# EAGLE design G792A (EAGLE 6.6.0)
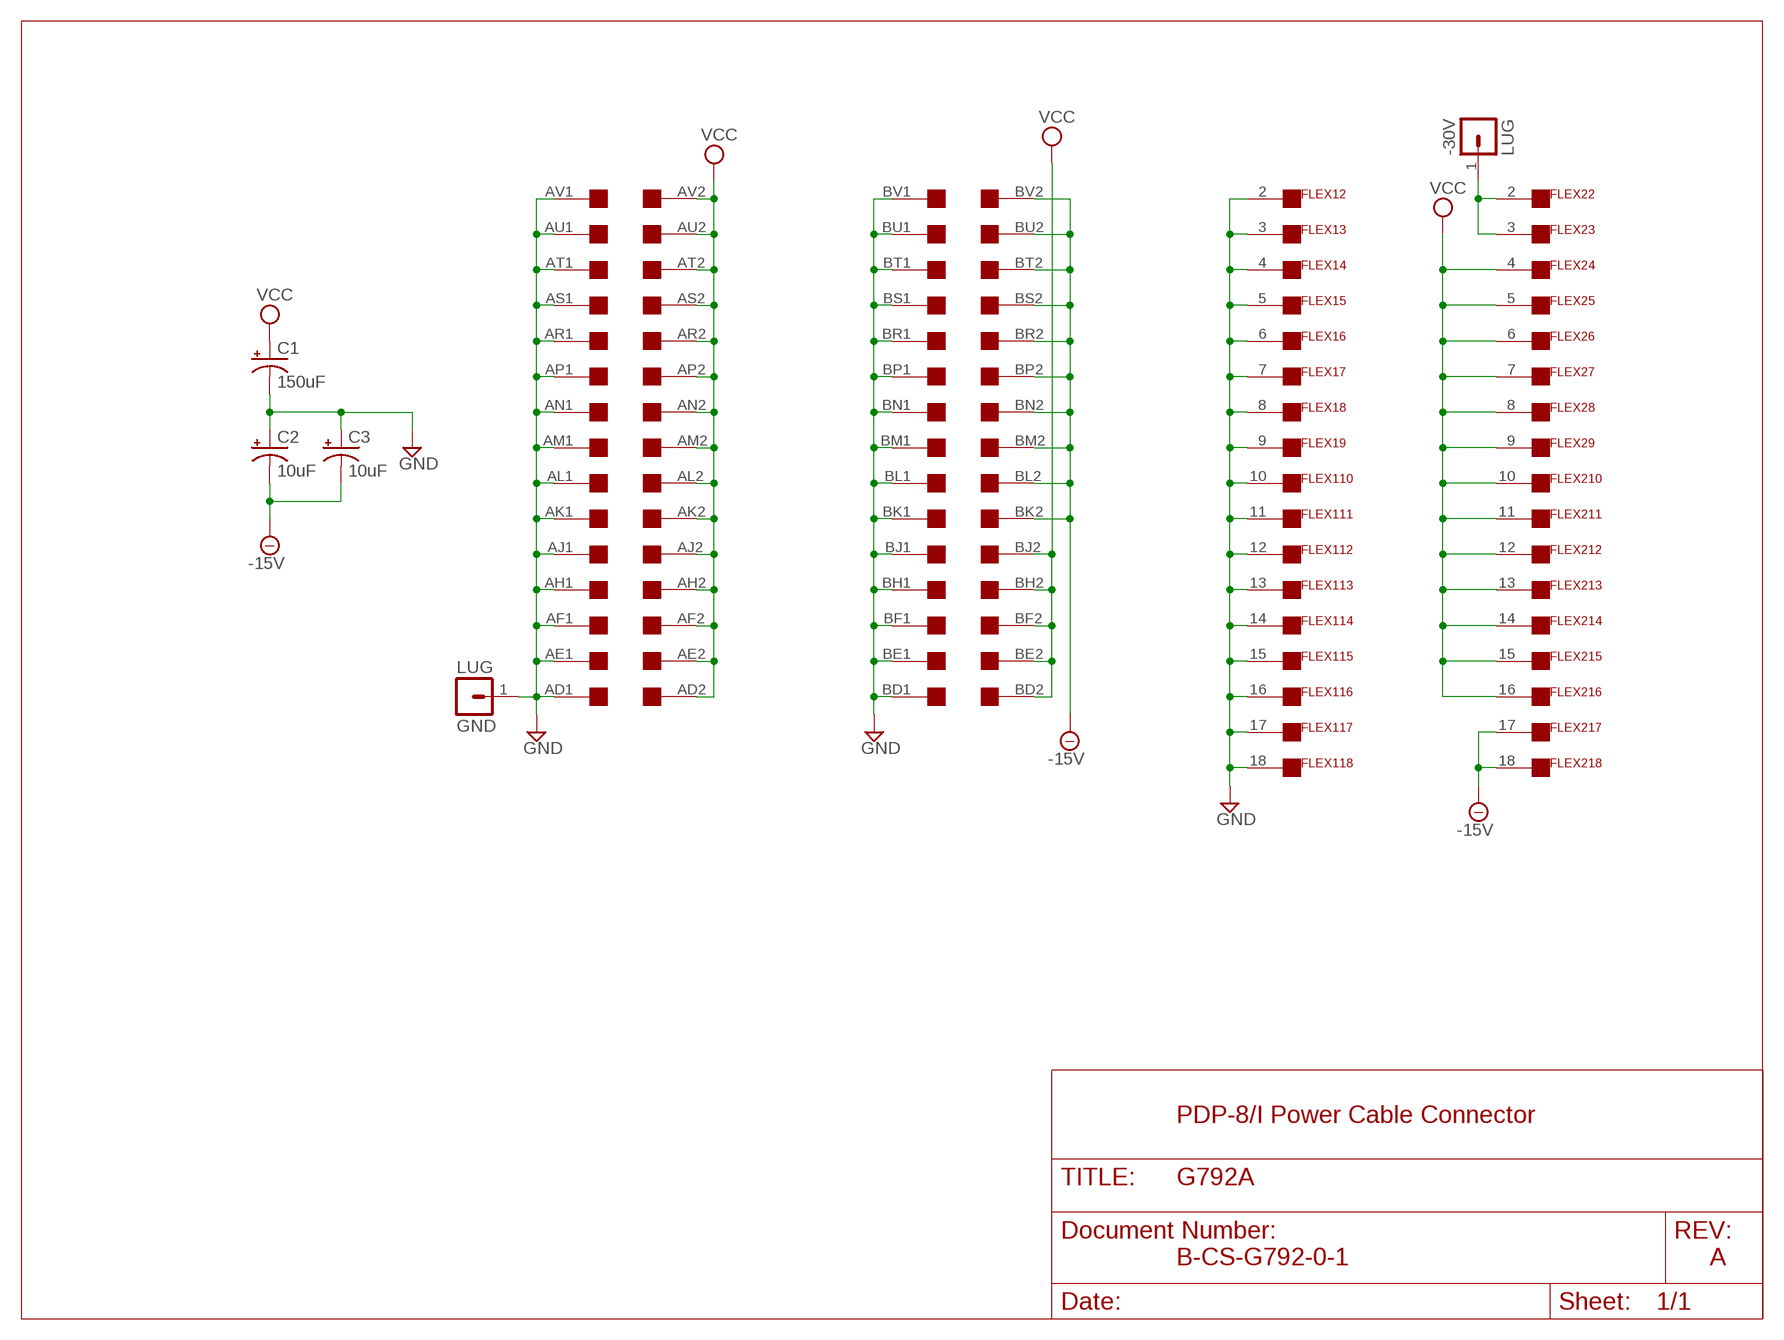
[diagram p0: schematic, sheet 1]

## Parts
-30V  LUG  [SPADELUG]
C1  150uF  CPOL-USE25-9AXIAL  [E25-9]
C2  10uF  CPOL-USE25-9AXIAL  [E25-9]
C3  10uF  CPOL-USE25-9AXIAL  [E25-9]
FLEX1  FLEX19W  [FLEX19W]
FLEX2  FLEX19W  [FLEX19W]
GND  LUG  [SPADELUG]
U$2  DOUBLE  [EDGE-CON4]

## Nets
-15V [supply]: C2.- C3.- FLEX2.17 FLEX2.18 U$2.BK2 U$2.BL2 U$2.BM2 U$2.BN2 U$2.BP2 U$2.BR2 U$2.BS2 U$2.BT2 U$2.BU2 U$2.BV2
-30V [supply]: -30V.1 FLEX2.2 FLEX2.3
GND [supply]: C1.- C2.+ C3.+ FLEX1.2 FLEX1.3 FLEX1.4 FLEX1.5 FLEX1.6 FLEX1.7 FLEX1.8 FLEX1.9 FLEX1.10 FLEX1.11 FLEX1.12 FLEX1.13 FLEX1.14 FLEX1.15 FLEX1.16 FLEX1.17 FLEX1.18 GND.1 U$2.AD1 U$2.AE1 U$2.AF1 U$2.AH1 U$2.AJ1 U$2.AK1 U$2.AL1 U$2.AM1 U$2.AN1 U$2.AP1 U$2.AR1 U$2.AS1 U$2.AT1 U$2.AU1 U$2.AV1 U$2.BD1 U$2.BE1 U$2.BF1 U$2.BH1 U$2.BJ1 U$2.BK1 U$2.BL1 U$2.BM1 U$2.BN1 U$2.BP1 U$2.BR1 U$2.BS1 U$2.BT1 U$2.BU1 U$2.BV1
VCC: C1.+ FLEX2.4 FLEX2.5 FLEX2.6 FLEX2.7 FLEX2.8 FLEX2.9 FLEX2.10 FLEX2.11 FLEX2.12 FLEX2.13 FLEX2.14 FLEX2.15 FLEX2.16 U$2.AD2 U$2.AE2 U$2.AF2 U$2.AH2 U$2.AJ2 U$2.AK2 U$2.AL2 U$2.AM2 U$2.AN2 U$2.AP2 U$2.AR2 U$2.AS2 U$2.AT2 U$2.AU2 U$2.AV2 U$2.BD2 U$2.BE2 U$2.BF2 U$2.BH2 U$2.BJ2
Unconnected: FLEX1.1 FLEX1.19 FLEX2.1 FLEX2.19 U$2.AA1 U$2.AA2 U$2.AB1 U$2.AB2 U$2.AC1 U$2.AC2 U$2.BA1 U$2.BA2 U$2.BB1 U$2.BB2 U$2.BC1 U$2.BC2

## Notes on the sheet
- PDP-8/I Power Cable Connector
- B-CS-G792-0-1 | A

## Library data of the parts
-30V GND = dec-con:LUG: Spade Lug
C1-C3 = rcl:CPOL-US: POLARIZED CAPACITOR, American symbol
FLEX1 FLEX2 = dec-con:FLEX19: 19 pin Flexprint Connection
U$2 = dec-con:DOUBLE: Double-Height DEC board

## Net classes
1 supply: width 0.813 mm

## Board
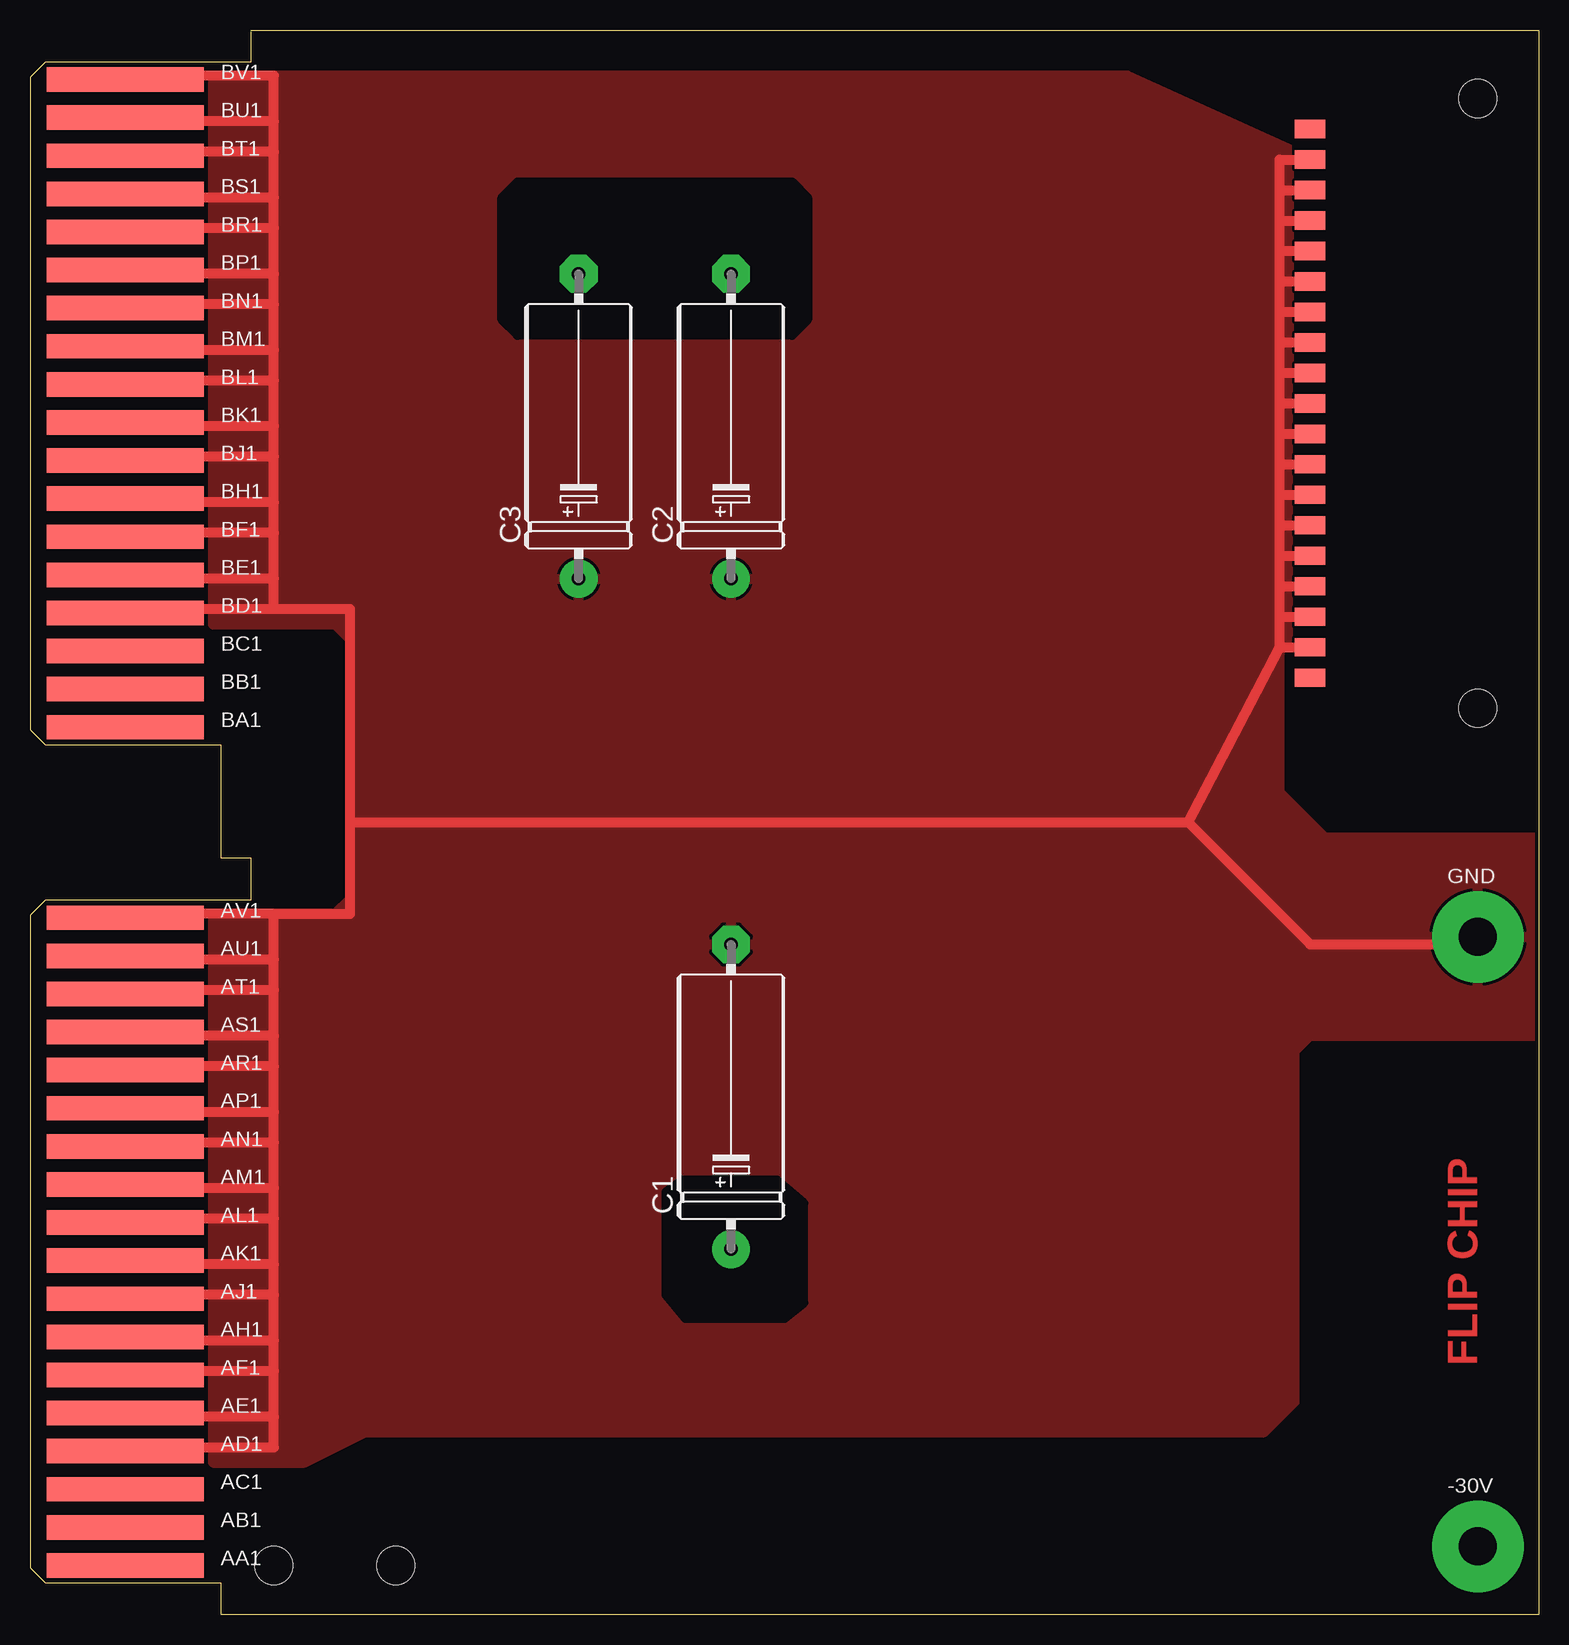
[diagram p1: board, top side]
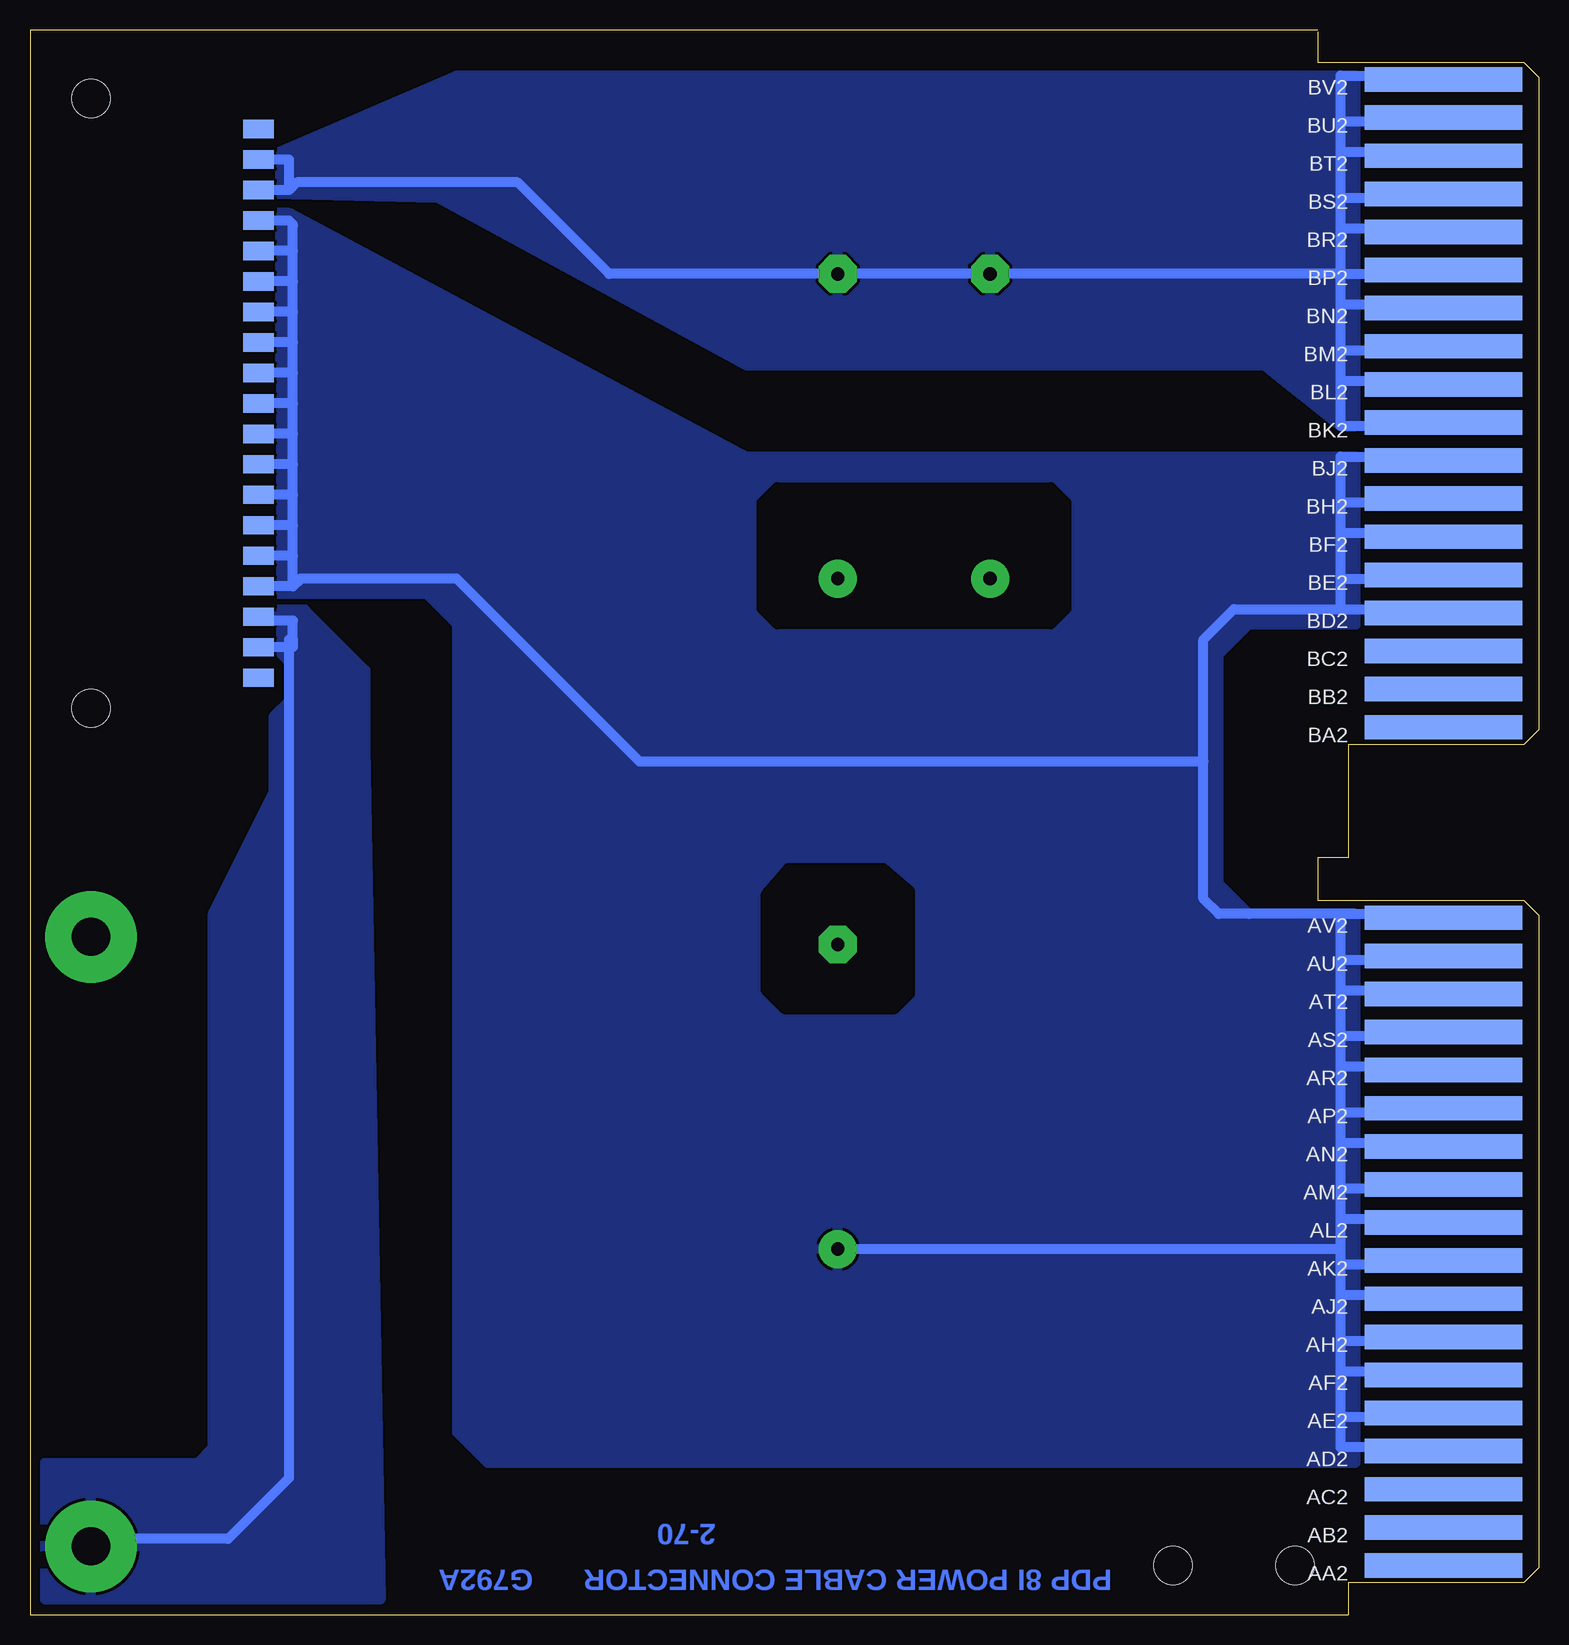
[diagram p2: board, bottom side, seen from below]

Size 125.73 x 132.08 mm. Coordinates in mm from the lower left corner, seen from the top.
Outline: 18.41,132.08 125.73,132.08 125.73,0 15.88,0
Copper layers (1+16): Top 0.035mm / dielectric 1.5mm / Bottom 0.035mm
Design rules "16mils": minimum track width 16mil, minimum drill 32mil, track to track 15mil, track to pad 10mil, pad to pad 10mil, via to via 10mil, smd to smd 10mil, copper to edge 13mil, drill to drill 10mil, minimum pad ring 10mil, minimum via ring 8mil, stop-mask expansion 0mil, vias tented up to drill 0mil, thermal gap 10mil
Holes 3.17 mm at 20.32,4.13 30.48,4.13 120.65,75.56 120.65,126.36
tRestrict: 16 lines
bRestrict: 16 lines

### Footprints (pad centres in the part's own frame; a part is rotated, then mirrored left to right if it is on the bottom)
SPADELUG = drill 3.175 pad 7.62: 1 0,0
E25-9 = drill 1.118 pad 3.15: + -12.7,0 | drill 1.118 pad 3.15 octagon: - 12.7,0
FLEX19W = smd 2.54 x 1.524: 1 0,22.86; 2 0,20.32; 3 0,17.78; 4 0,15.24; 5 0,12.7; 6 0,10.16; 7 0,7.62; 8 0,5.08; 9 0,2.54; 10 0,0; 11 0,-2.54; 12 0,-5.08; 13 0,-7.62; 14 0,-10.16; 15 0,-12.7; 16 0,-15.24; 17 0,-17.78; 18 0,-20.32; 19 0,-22.86
EDGE-CON4 = smd 13.106 x 2.032: AA1 7.938,4.128; AB1 7.938,7.303; AC1 7.938,10.477; AD1 7.938,13.652; AE1 7.938,16.828; AF1 7.938,20.003; AH1 7.938,23.177; AJ1 7.938,26.352; AK1 7.938,29.527; AL1 7.938,32.703; AM1 7.938,35.877; AN1 7.938,39.053; AP1 7.938,42.227; AR1 7.938,45.403; AS1 7.938,48.578; AT1 7.938,51.752; AU1 7.938,54.928; AV1 7.938,58.102; BA1 7.938,73.978; BB1 7.938,77.153; BC1 7.938,80.328; BD1 7.938,83.502; BE1 7.938,86.677; BF1 7.938,89.853; BH1 7.938,93.028; BJ1 7.938,96.203; BK1 7.938,99.377; BL1 7.938,102.552; BM1 7.938,105.728; BN1 7.938,108.903; BP1 7.938,112.078; BR1 7.938,115.252; BS1 7.938,118.427; BT1 7.938,121.603; BU1 7.938,124.778; BV1 7.938,127.953 | smd 13.106 x 2.032 bottom: AA2 7.938,4.128; AB2 7.938,7.303; AC2 7.938,10.477; AD2 7.938,13.652; AE2 7.938,16.828; AF2 7.938,20.003; AH2 7.938,23.177; AJ2 7.938,26.352; AK2 7.938,29.527; AL2 7.938,32.703; AM2 7.938,35.877; AN2 7.938,39.053; AP2 7.938,42.227; AR2 7.938,45.403; AS2 7.938,48.578; AT2 7.938,51.752; AU2 7.938,54.928; AV2 7.938,58.102; BA2 7.938,73.978; BB2 7.938,77.153; BC2 7.938,80.328; BD2 7.938,83.502; BE2 7.938,86.677; BF2 7.938,89.853; BH2 7.938,93.028; BJ2 7.938,96.203; BK2 7.938,99.377; BL2 7.938,102.552; BM2 7.938,105.728; BN2 7.938,108.903; BP2 7.938,112.078; BR2 7.938,115.252; BS2 7.938,118.427; BT2 7.938,121.603; BU2 7.938,124.778; BV2 7.938,127.953

### Placement (x,y rotation side)
-30V  120.65,5.71 0 top
C1  58.42,43.18 90 top
C2  58.42,99.06 90 top
C3  45.72,99.06 90 top
FLEX1  106.68,100.97 0 top
FLEX2  106.68,100.97 180 bottom
GND  120.65,56.52 0 top
U$2  0,0 0 top
U$3  [FLIPCHIP]  123.19,57.15 180 top

### Tracks (layer width: path | path; a pad name or v marks a point on that pad's centre or on a via)
-15V
  Bottom 0.813: FLEX2.18 104.14,121.28 104.14,118.75 | 104.14,118.75 FLEX2.17 | U$2.BV2 8.26,128.27 16.51,128.27 16.51,124.46 | 16.51,102.87 16.51,99.06 8.26,99.06 U$2.BK2 | 16.51,102.87 16.51,105.41 | 16.51,105.41 16.51,109.22 | 16.51,109.22 16.51,111.76 | 16.51,111.76 16.51,115.57 | 16.51,115.57 16.51,118.11 | 16.51,118.11 16.51,121.92 | 16.51,121.92 16.51,124.46 | U$2.BL2 8.26,102.87 16.51,102.87 | U$2.BM2 8.26,105.41 16.51,105.41 | U$2.BN2 8.26,109.22 16.51,109.22 | U$2.BP2 8.26,111.76 16.51,111.76 | U$2.BR2 8.26,115.57 16.51,115.57 | U$2.BS2 8.26,118.11 16.51,118.11 | U$2.BT2 8.26,121.92 16.51,121.92 | U$2.BU2 8.26,124.46 16.51,124.46 | 16.51,111.76 C3.- C2.- 77.47,111.76 85.09,119.38 103.5,119.38 104.14,118.75
  pour Bottom: 15.24,128.27 90.17,128.27 105.73,121.6 105.73,118.43 91.76,118.11 66.04,104.14 22.86,104.14 16.51,99.06 15.24,99.06
-30V
  Bottom 0.813: FLEX2.3 106.36,82.87 103.82,82.87 103.82,81.28 | 103.82,81.28 103.82,80.64 FLEX2.2 | -30V.1 120.02,6.35 109.22,6.35 104.14,11.43 104.14,81.28 103.82,81.28
  pour Bottom: 105.41,83.82 102.87,83.82 97.79,78.74 97.79,72.39 96.52,1.27 124.46,1.27 124.46,12.7 111.76,12.7 110.49,13.97 110.49,58.42 105.41,68.58 105.41,74.93 104.14,76.2 104.14,79.38 105.41,80.64
GND
  Top 0.813: U$2.AD1 8.26,13.97 20.32,13.97 20.32,16.51 | U$2.BV1 8.26,128.27 20.32,128.27 20.32,124.46 | 20.32,16.51 20.32,20.32 | 20.32,20.32 20.32,22.86 | 20.32,22.86 20.32,26.67 | 20.32,26.67 20.32,29.21 | 20.32,29.21 20.32,33.02 | 20.32,33.02 20.32,35.56 | 20.32,35.56 20.32,39.37 | 20.32,39.37 20.32,41.91 | 20.32,41.91 20.32,45.72 | 20.32,45.72 20.32,48.26 | 20.32,48.26 20.32,52.07 | 20.32,52.07 20.32,54.61 | 20.32,54.61 20.32,58.42 | 20.32,58.42 26.67,58.42 26.67,66.04 | 26.67,66.04 26.67,83.82 20.32,83.82 | 20.32,83.82 20.32,86.36 | 20.32,86.36 20.32,90.17 | 20.32,90.17 20.32,92.71 | 20.32,92.71 20.32,96.52 | 20.32,96.52 20.32,99.06 | 20.32,99.06 20.32,102.87 | 20.32,102.87 20.32,105.41 | 20.32,105.41 20.32,109.22 | 20.32,109.22 20.32,111.76 | 20.32,111.76 20.32,115.57 | 20.32,115.57 20.32,118.11 | 20.32,118.11 20.32,121.92 | 20.32,121.92 20.32,124.46 | U$2.BU1 8.26,124.46 20.32,124.46 | U$2.BT1 8.26,121.92 20.32,121.92 | U$2.BS1 8.26,118.11 20.32,118.11 | U$2.BR1 8.26,115.57 20.32,115.57 | U$2.BP1 8.26,111.76 20.32,111.76 | U$2.BN1 8.89,109.22 20.32,109.22 | U$2.BM1 8.26,105.41 20.32,105.41 | U$2.BL1 8.26,102.87 20.32,102.87 | U$2.BK1 8.26,99.06 20.32,99.06 | U$2.BD1 8.26,83.82 20.32,83.82 | U$2.BE1 8.26,86.36 20.32,86.36 | U$2.BF1 8.26,90.17 20.32,90.17 | U$2.BH1 8.26,92.71 20.32,92.71 | U$2.BJ1 8.26,96.52 20.32,96.52 | U$2.AV1 8.26,58.42 20.32,58.42 | U$2.AU1 8.26,54.61 20.32,54.61 | U$2.AT1 8.26,52.07 20.32,52.07 | U$2.AS1 8.26,48.26 20.32,48.26 | U$2.AR1 8.26,45.72 20.32,45.72 | U$2.AE1 8.26,16.51 20.32,16.51 | U$2.AF1 8.26,20.32 20.32,20.32 | U$2.AH1 8.26,22.86 20.32,22.86 | U$2.AJ1 8.26,26.67 20.32,26.67 | U$2.AK1 8.26,29.21 20.32,29.21
  Top 0.813: U$2.AL1 8.26,33.02 20.32,33.02 | U$2.AM1 8.26,35.56 20.32,35.56 | U$2.AN1 8.26,39.37 20.32,39.37 | U$2.AP1 8.26,41.91 20.32,41.91 | 96.52,66.04 106.68,55.88 119.38,55.88 GND.1 | 26.67,66.04 96.52,66.04 | 96.52,66.04 104.14,80.64 | 104.14,80.64 104.14,83.19 | 104.14,83.19 104.14,85.72 | 104.14,85.72 104.14,88.27 | 104.14,88.27 104.14,90.81 | 104.14,90.81 104.14,93.34 | 104.14,93.34 104.14,95.89 | 104.14,95.89 104.14,98.42 | 104.14,98.42 104.14,100.97 | 104.14,100.97 104.14,103.5 | 104.14,103.5 104.14,106.05 | 104.14,106.05 104.14,108.58 | 104.14,108.58 104.14,111.12 | 104.14,111.12 104.14,113.67 | 104.14,113.67 104.14,116.2 | 104.14,116.2 104.14,118.75 | 104.14,118.75 104.14,121.28 FLEX1.2 | 104.14,118.75 FLEX1.3 | 104.14,116.2 FLEX1.4 | 104.14,113.67 FLEX1.5 | 104.14,111.12 FLEX1.6 | 104.14,108.58 FLEX1.7 | 104.14,106.05 FLEX1.8 | 104.14,103.5 FLEX1.9 | 104.14,100.97 FLEX1.10 | 104.14,95.89 FLEX1.12 | 104.14,98.42 FLEX1.11 | 104.14,93.34 FLEX1.13 | 104.14,80.64 FLEX1.18 | 104.14,83.19 FLEX1.17 | 104.14,85.72 FLEX1.16 | 104.14,88.27 FLEX1.15 | 104.14,90.81 FLEX1.14
  pour Top: 15.24,12.7 22.86,12.7 27.94,15.24 102.87,15.24 105.41,17.78 105.41,46.99 106.68,48.26 125.73,48.26 125.73,64.77 107.95,64.77 104.14,68.58 104.14,80.64 105.41,80.64 105.41,121.92 91.44,128.27 15.24,128.27 15.24,82.55 25.4,82.55 26.67,81.28 26.67,59.69 25.4,58.42 15.24,58.42
VCC
  Bottom 0.813: U$2.BJ2 8.18,96.45 arc-45 8.36,96.52 16.51,96.52 16.51,92.71 | 16.51,83.82 16.51,86.36 | 16.51,86.36 16.51,90.17 | 16.51,90.17 16.51,92.71 | U$2.BD2 8.18,83.75 arc-45 8.36,83.82 16.51,83.82 | U$2.BE2 8.18,86.43 arc45 8.36,86.36 16.51,86.36 | U$2.BF2 8.18,90.1 arc-45 8.36,90.17 16.51,90.17 | U$2.BH2 8.18,92.78 arc45 8.36,92.71 16.51,92.71 | 16.51,83.82 25.4,83.82 27.94,81.28 27.94,71.12 | 27.94,71.12 27.94,59.69 26.67,58.42 24.13,58.42 | U$2.AV2 8.18,58.35 arc-45 8.36,58.42 15.24,58.42 | 16.51,58.42 15.24,58.42 | 16.51,58.42 24.13,58.42 | U$2.AD2 8.18,13.9 arc-45 8.36,13.97 16.51,13.97 16.51,16.51 | 16.51,16.51 16.51,20.32 | 16.51,20.32 16.51,22.86 | 16.51,22.86 16.51,26.67 | 16.51,26.67 16.51,29.21 | 16.51,29.21 16.51,30.48 | 16.51,30.48 16.51,33.02 | 16.51,33.02 16.51,35.56 | 16.51,35.56 16.51,39.37 | 16.51,39.37 16.51,41.91 | 16.51,41.91 16.51,45.72 | 16.51,45.72 16.51,48.26 | 16.51,48.26 16.51,52.07 | 16.51,52.07 16.51,54.61 | 16.51,54.61 16.51,58.42 | U$2.AE2 8.18,16.58 arc45 8.36,16.51 16.51,16.51 | U$2.AF2 8.18,20.25 arc-45 8.36,20.32 16.51,20.32 | U$2.AH2 8.18,22.93 arc45 8.36,22.86 16.51,22.86 | U$2.AJ2 8.18,26.6 arc-45 8.36,26.67 16.51,26.67 | U$2.AK2 8.18,29.28 arc45 8.36,29.21 16.51,29.21 | U$2.AL2 8.18,32.95 arc-45 8.36,33.02 16.51,33.02 | U$2.AM2 8.18,35.63 arc45 8.36,35.56 16.51,35.56 | U$2.AU2 8.18,54.68 arc45 8.36,54.61 16.51,54.61 | U$2.AT2 8.18,52 arc-45 8.36,52.07 16.51,52.07 | U$2.AS2 8.18,48.33 arc45 8.36,48.26 16.51,48.26 | U$2.AR2 8.18,45.65 arc-45 8.36,45.72 16.51,45.72 | U$2.AP2 8.18,41.98 arc45 8.36,41.91 16.51,41.91 | U$2.AN2 8.18,39.3 arc-45 8.36,39.37 16.51,39.37 | 16.51,30.48 C1.+
  Bottom 0.813: FLEX2.16 104.14,116.2 103.9,115.96 arc45 103.82,115.78 103.82,113.67 | 103.82,85.72 103.82,88.27 | 103.82,88.27 103.82,90.81 | 103.82,90.81 103.82,93.34 | 103.82,93.34 103.82,95.89 | 103.82,95.89 103.82,98.42 | 103.82,98.42 103.82,100.97 | 103.82,100.97 103.82,103.5 | 103.82,103.5 103.82,106.05 | 103.82,106.05 103.82,108.58 | 103.82,108.58 103.82,111.12 | 103.82,111.12 103.82,113.67 | 103.82,85.72 FLEX2.4 | 103.82,88.27 FLEX2.5 | 103.82,90.81 FLEX2.6 | 103.82,93.34 FLEX2.7 | 103.82,95.89 FLEX2.8 | 103.82,98.42 FLEX2.9 | 103.82,100.97 FLEX2.10 | 103.82,113.67 FLEX2.15 | 103.82,111.12 FLEX2.14 | 103.82,108.58 FLEX2.13 | 103.82,106.05 FLEX2.12 | 103.82,103.5 FLEX2.11 | 103.82,85.72 103.19,86.36 90.17,86.36 74.93,71.12 27.94,71.12 | 15.24,58.42 24.13,58.42
  pour Bottom: 15.24,96.52 66.04,96.52 104.14,116.84 105.41,116.84 105.41,85.09 92.71,85.09 90.17,82.55 90.17,15.24 87.63,12.7 15.24,12.7 15.24,58.42 24.13,58.42 26.67,60.96 26.67,80.01 24.13,82.55 15.24,82.55

### Text on the board
Bottom: 2-70 | PDP 8I POWER CABLE CONNECTOR | G792A